# EAGLE design ac_alarm (EAGLE 5.09)
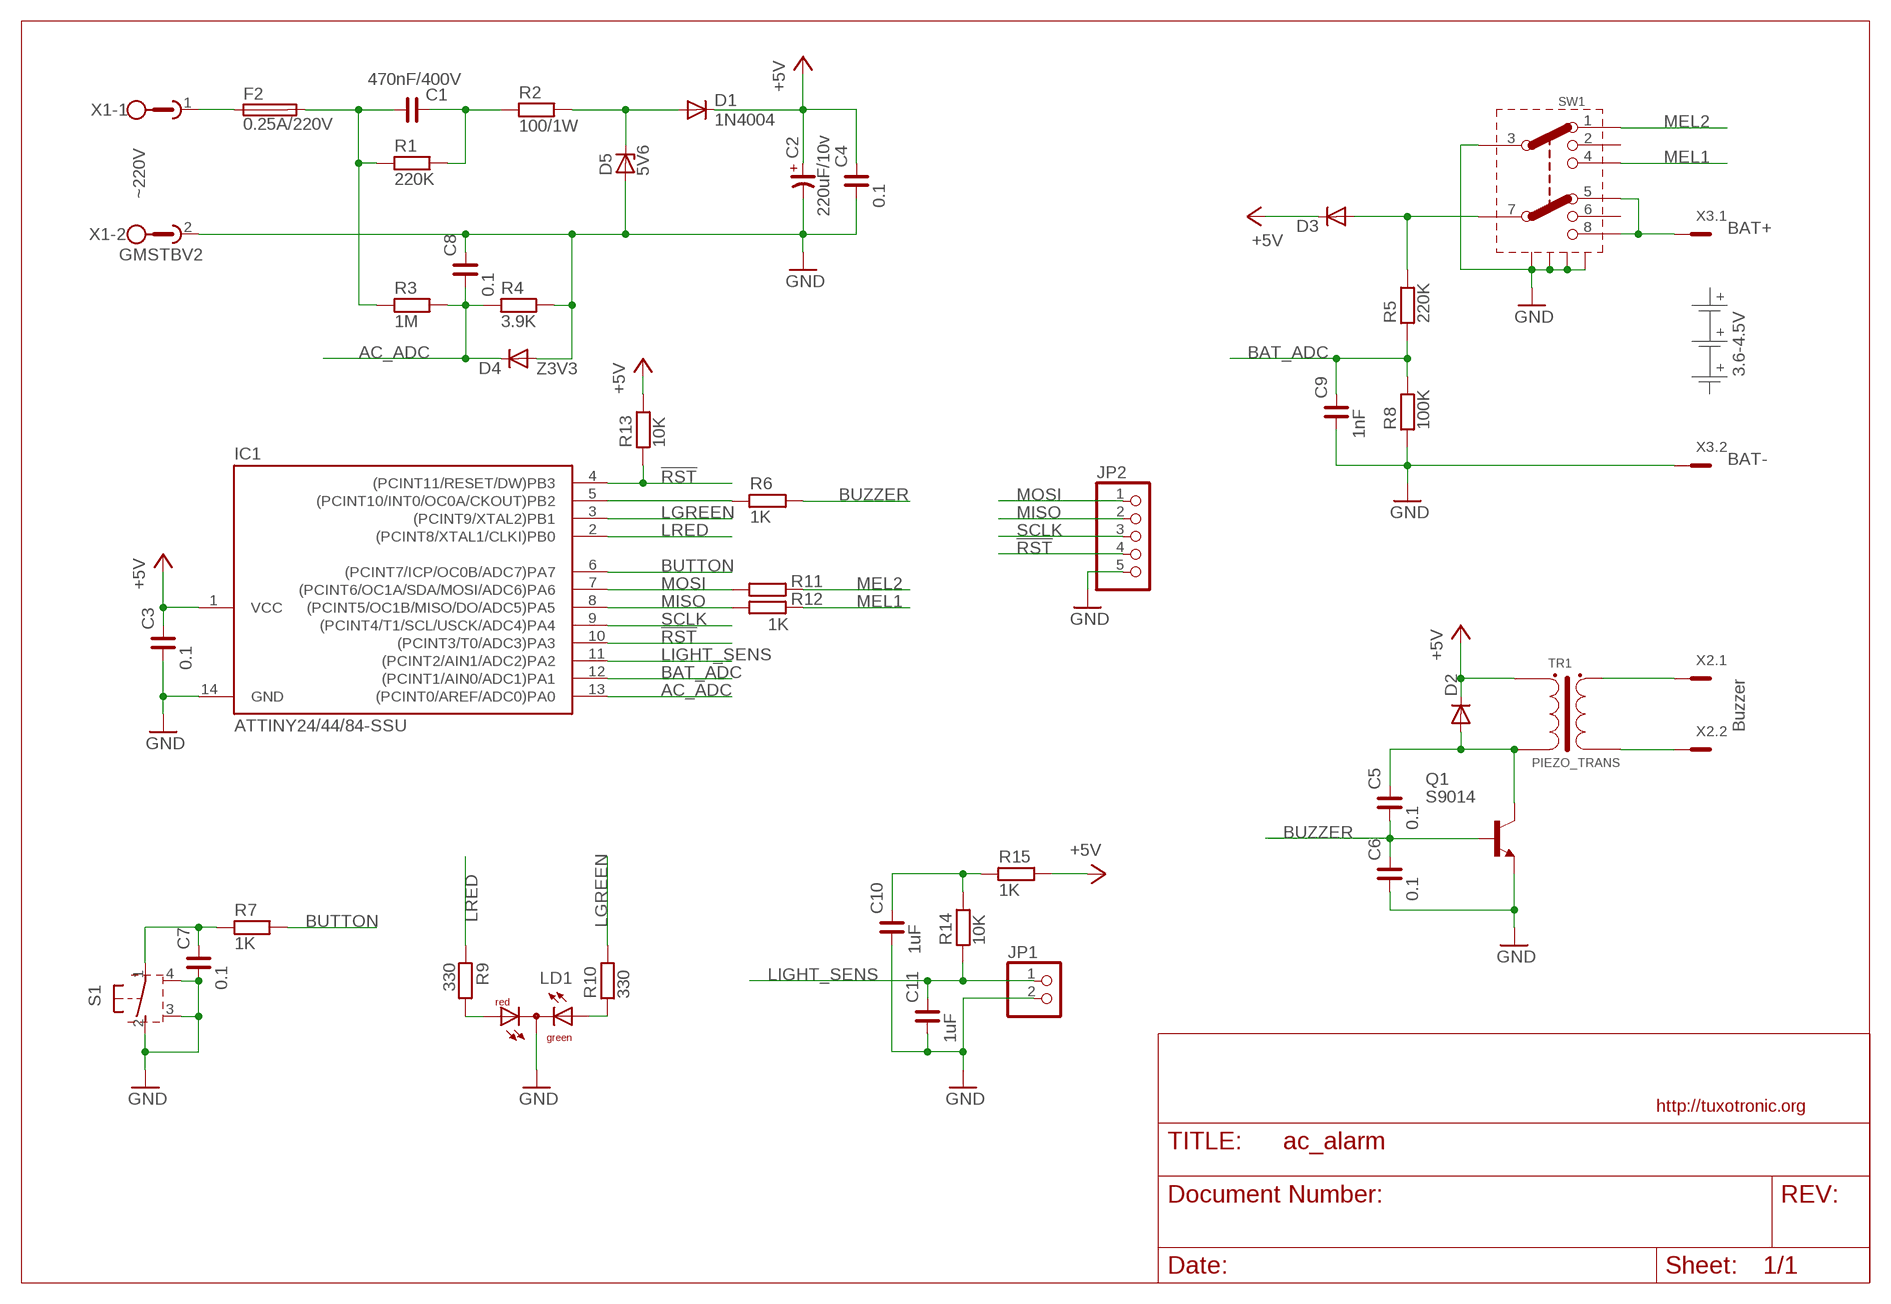
[diagram p0: schematic, sheet 1]

## Parts
C1  470nF/400V  C_C200-230X080  [C200-230X080]
C2  220uF/10v  CP_TT050-080  [CTT-050-080]
C3  0.1  C_0805  [C0805]
C4  0.1  C_C025-050X025  [C025-050X025]
C5  0.1  C_0805  [C0805]
C6  0.1  C_0805  [C0805]
C7  0.1  C_0805  [C0805]
C8  0.1  C_0805  [C0805]
C9  1nF  C_0805  [C0805]
C10  1uF  C_0805  [C0805]
C11  1uF  C_0805  [C0805]
D1  1N4004  1N4148DO35-10  [DO35-10]
D2  DIODE-MELF-MLL41  [MELF-MLL41]
D3  DIODE-MELF-MLL41  [MELF-MLL41]
D4  Z3V3  DIODE-MELF-MLL41  [MELF-MLL41]
D5  5V6  BZD23  [SOD81]
F2  0.25A/220V  PICOFUSE  [PICOFUSE]
IC1  ATTINY24/44/84-SSU  [SOIC14]
JP1  PINHD-1X2_2.54  [1X02]
JP2  PINHD-1X5_2.00  [1X05M]
LD1  DUOLED-RG-C  [DUOLED-C-5MM]
Q1  S9014  2N5089  [TO92]
R1  220K  R_X0309/10  [0309/10]
R2  100/1W  R_X0309/12  [0309/12]
R3  1M  R_0805  [R0805]
R4  3.9K  R_0805  [R0805]
R5  220K  R_0805  [R0805]
R6  1K  R_0805  [R0805]
R7  1K  R_0805  [R0805]
R8  100K  R_0805  [R0805]
R9  330  R_0805  [R0805]
R10  330  R_0805  [R0805]
R11  1K  R_0805  [R0805]
R12  1K  R_0805  [R0805]
R13  10K  R_0805  [R0805]
R14  10K  R_0805  [R0805]
R15  1K  R_0805  [R0805]
S1  31-XX  [B3F-31XX]
SW1  3SWITCH  [3SWITCH]
TR1  PIEZO_TRANS  [PIEZOTRANS]
X1  GMSTBV2  [GMSTBV2]
X2  MCV2  [MCV2]
X3  MCV2  [MCV2]

## Nets
!RST: IC1.4((PCINT11/RESET/DW)PB3) IC1.10((PCINT3/T0/ADC3)PA3) JP2.4 R13.1
+5V: C2.+ C3.2 C4.2 D1.C D2.C D3.C IC1.1(VCC) R13.2 R15.2 TR1.A1
AC_ADC: C8.1 D4.C IC1.13((PCINT0/AREF/ADC0)PA0) R3.2 R4.1
BAT_ADC: C9.2 IC1.12((PCINT1/AIN0/ADC1)PA1) R5.1 R8.2
BUTTON: IC1.6((PCINT7/ICP/OC0B/ADC7)PA7) R7.2
BUZZER: C5.1 C6.2 Q1.2(B) R6.2
GND: C2.- C3.1 C4.1 C6.1 C7.1 C8.2 C9.1 C10.1 C11.1 D4.A D5.A IC1.14(GND) JP1.2 JP2.5 LD1.C Q1.3(E) R4.2 R8.1 S1.2(S) S1.3(GND1) S1.4(GND2) SW1.3(AG) SW1.SH1 SW1.SH2 SW1.SH3 SW1.SH4 X1.2 X3.2
HOT: C1.1 F2.2 R1.1 R3.1
LGREEN: IC1.3((PCINT9/XTAL2)PB1) R10.2
LIGHT_SENS: C11.2 IC1.11((PCINT2/AIN1/ADC2)PA2) JP1.1 R14.1
LRED: IC1.2((PCINT8/XTAL1/CLKI)PB0) R9.1
MEL1: R12.2 SW1.4(A3)
MEL2: R11.2 SW1.1(A1)
MISO: IC1.8((PCINT5/OC1B/MISO/DO/ADC5)PA5) JP2.2 R12.1
MOSI: IC1.7((PCINT6/OC1A/SDA/MOSI/ADC6)PA6) JP2.1 R11.1
N$1: F2.1 X1.1
N$2: C1.2 R1.2 R2.1
N$3: D1.A D5.C R2.2
N$4: C5.2 D2.A Q1.1(C) TR1.A2
N$5: LD1.AR R9.2
N$6: TR1.B1 X2.1
N$7: TR1.B2 X2.2
N$8: C7.2 R7.1 S1.1(P)
N$9: SW1.5(B1) SW1.8(B3) X3.1
N$10: D3.A R5.2 SW1.7(BG)
N$11: LD1.AX(AG) R10.1
N$12: IC1.5((PCINT10/INT0/OC0A/CKOUT)PB2) R6.1
N$14: C10.2 R14.2 R15.1
SCLK: IC1.9((PCINT4/T1/SCL/USCK/ADC4)PA4) JP2.3
Unconnected: SW1.2(A2) SW1.6(B2)

## Notes on the sheet
- ~220V
- BAT+
- 3.6-4.5V
- BAT-
- Buzzer

## Library data of the parts
C1 C3-C11 = rc-master:C_: NON-POLARIZED CAP
C2 = rc-master:CP_: POLARIZED CAP
D1 = diode:1N4148: DIODE high speed (Philips)
D2-D4 = discrete:DIODE-: DIODE
D5 = diode:BZD23: Z DIODE
F2 = fuse:PICOFUSE: PICOFUSE 19275, Wickmann
IC1 = attiny24_44_84:ATTINY24/44/84
JP1 = pinhead-fixdrills:PINHD-1X2: PIN HEADER
JP2 = pinhead-fixdrills:PINHD-1X5: PIN HEADER
LD1 = led:DUOLED-RG-C: DUO LED 2 colors (red/green), 5 mm, round, common Cathode www.ligitek.com or other producers.
Q1 = transistor-npn:2N5089: NPN Transistor
R1-R4 R7 = rc-master:R_: RESISTOR
R5 R6 R8-R15 = rc-master-smd:R_: RESISTOR
S1 = buttons:31-XX: OMRON SWITCH
SW1 = switch:3SWITCH
TR1 = switch:PIEZO_TRANS
X1 = con-phoenix-508:GMSTBV2: PHOENIX
X2 X3 = con-phoenix-381_l:MCV2: Mini-Combicon 3.81mm vertikal 2polig (ohne Gegenstecker)

## Board
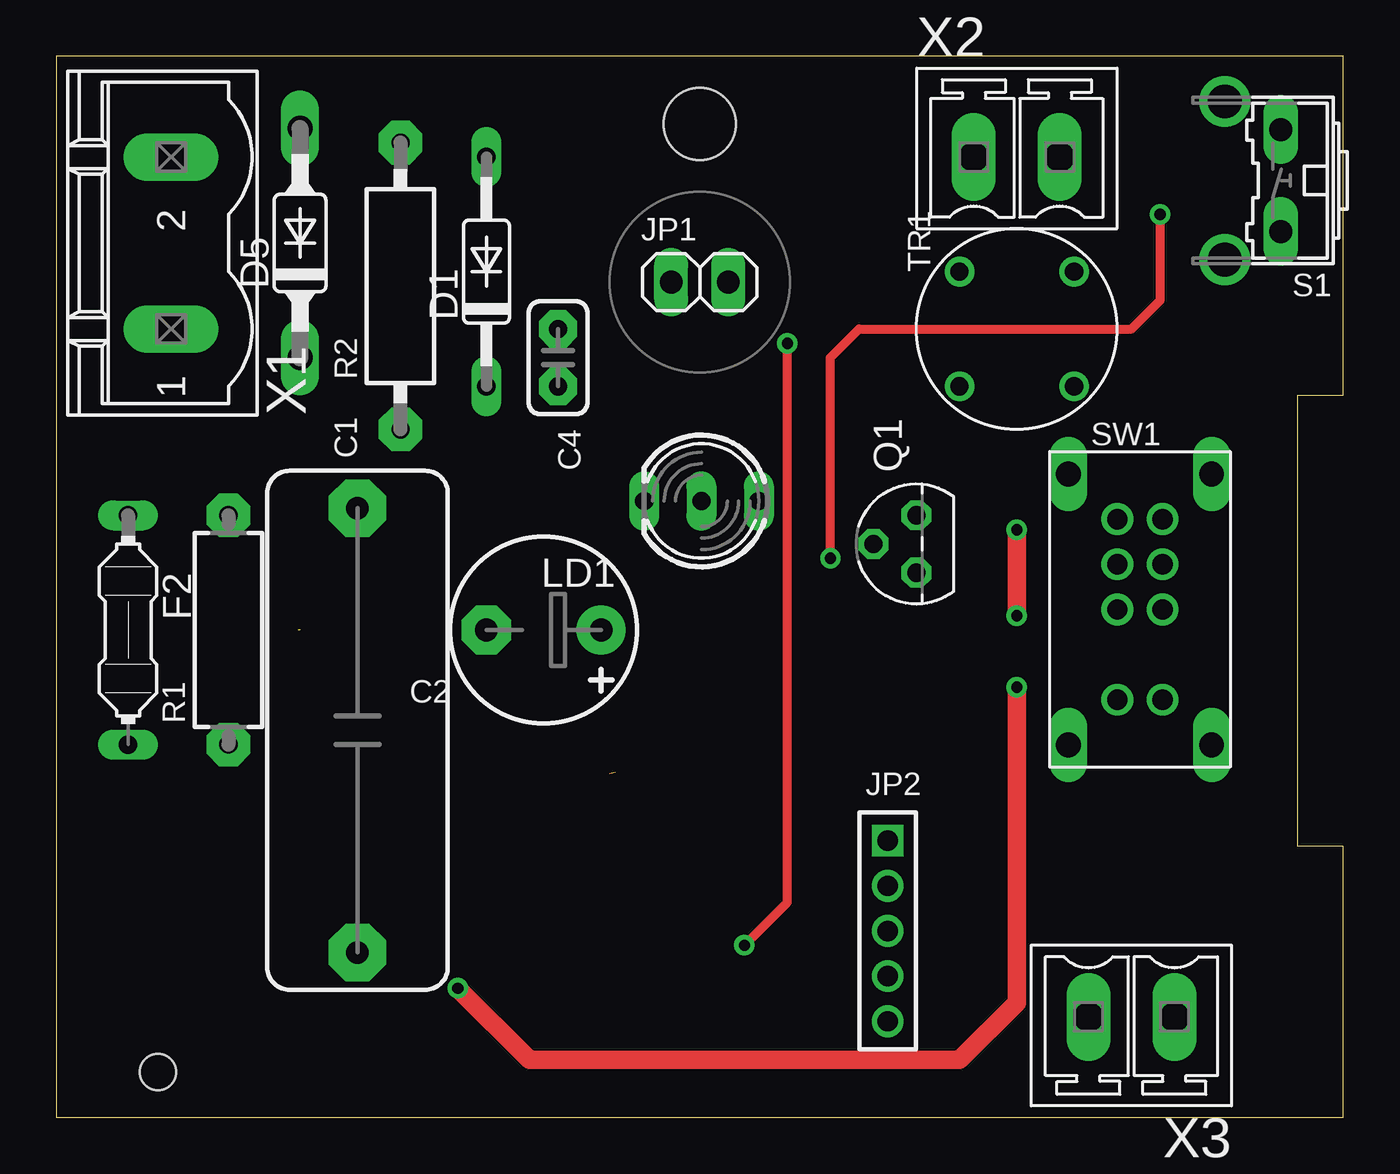
[diagram p1: board, top side]
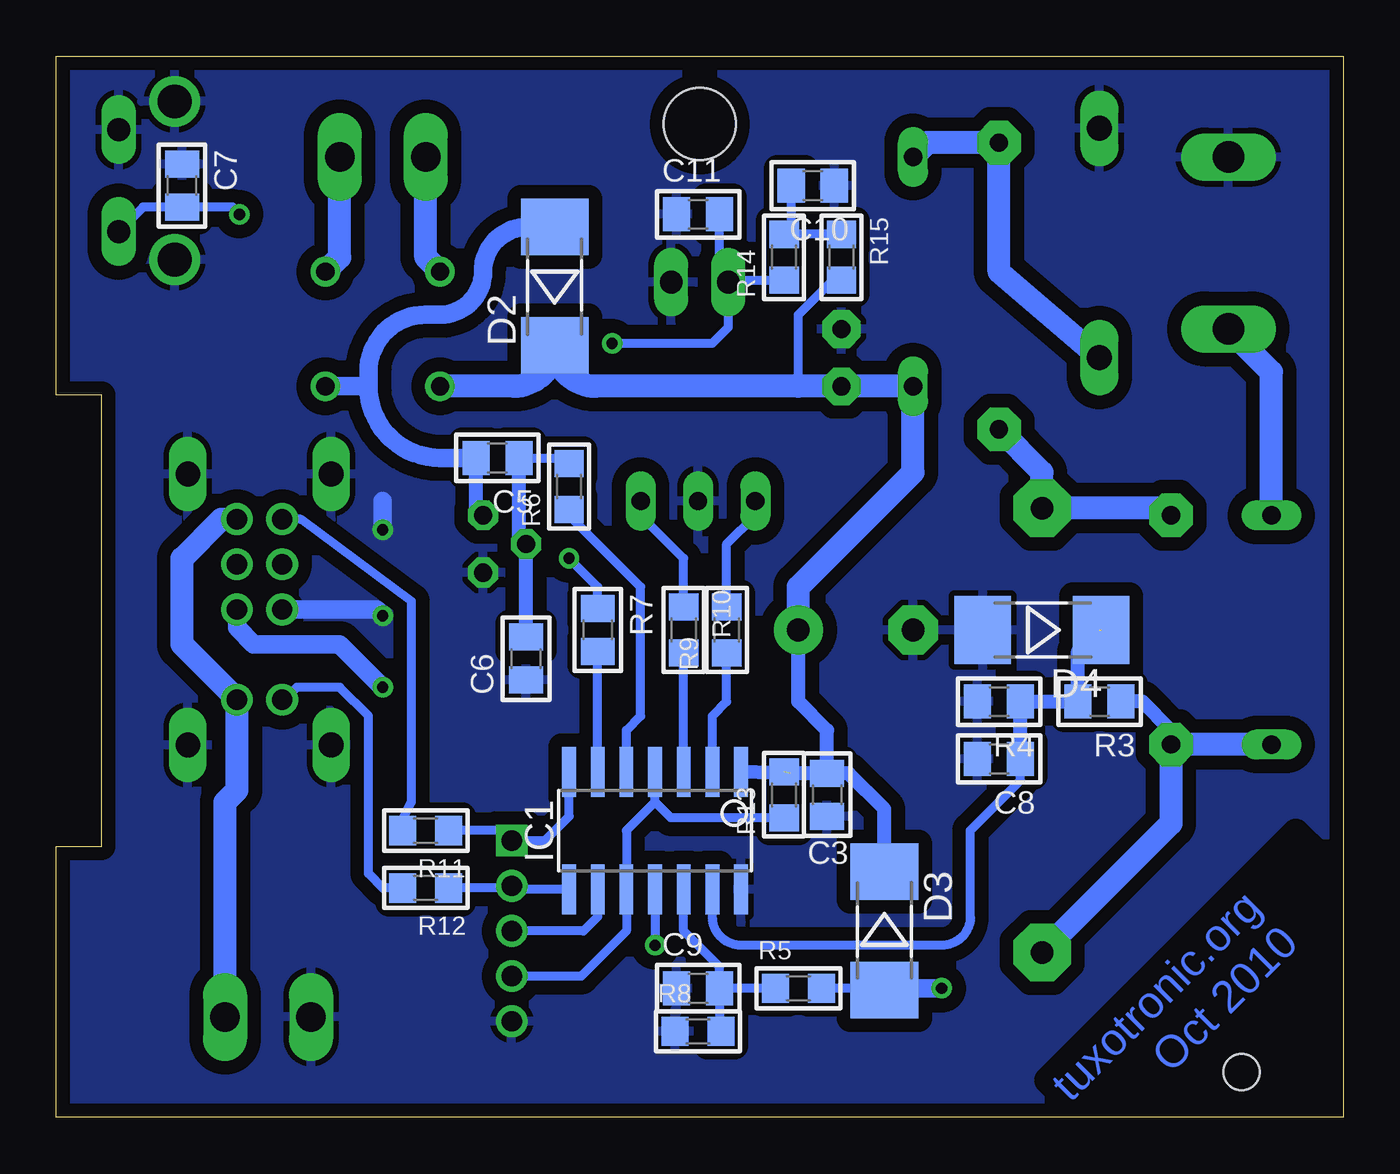
[diagram p2: board, bottom side, seen from below]

Size 57 x 47 mm. Coordinates in mm from the lower left corner, seen from the top.
Outline: 0,0 57,0 57,12 55,12 55,32 57,32 57,47 0,47 0,0
Copper layers (1*16): Top 0.035mm / dielectric 1.5mm / Bottom 0.035mm
Design rules "default *": minimum track width 10mil, minimum drill 24mil, track to track 8mil, track to pad 8mil, pad to pad 8mil, via to via 8mil, smd to smd 8mil, copper to edge 0.5mm, drill to drill 8mil, minimum pad ring 10mil, minimum via ring 8mil, stop-mask expansion 4mil, vias tented up to drill 0mil, thermal gap 10mil
Holes 3.2 mm at 28.5,44
Holes 1.6 mm at 4.5,2

### Footprints (pad centres in the part's own frame; a part is rotated, then mirrored left to right if it is on the bottom)
C200-230X080 = drill 1 pad 2.54 octagon: 1 -9.842,0; 2 9.842,0
CTT-050-080 = drill 1 pad 2.184 round: + -2.54,0 | drill 1 pad 2.184 octagon: - 2.54,0
C0805 = smd 1.2 x 1.5: 1 -0.953,0; 2 0.953,0
C025-050X025 = drill 0.8 pad 1.676 octagon: 1 -1.27,0; 2 1.27,0
DO35-10 = drill 0.813 long: A 5.08,0; C -5.08,0
MELF-MLL41 = smd 2.5 x 3: A 2.625,0; C -2.625,0
SOD81 = drill 1.118 long: A 5.08,0; C -5.08,0
PICOFUSE = drill 0.813 long: 1 -5.08,0; 2 5.08,0
SOIC14 = smd 0.61 x 2.21: 1 -3.81,-2.603; 2 -2.54,-2.603; 3 -1.27,-2.603; 4 0,-2.603; 5 1.27,-2.603; 6 2.54,-2.603; 7 3.81,-2.603; 8 3.81,2.603; 9 2.54,2.603; 10 1.27,2.603; 11 0,2.603; 12 -1.27,2.603; 13 -2.54,2.603; 14 -3.81,2.603
1X02 = drill 1 long: 1 -1.27,0; 2 1.27,0
1X05M = drill 0.9 square: 1 -4,0 | drill 0.9 round: 2 -2,0; 3 0,0; 4 2,0; 5 4,0
DUOLED-C-5MM = drill 0.813 long: AR 2.54,0; AX -2.54,0; C 0,0
TO92 = drill 0.813 octagon: 1 1.27,0; 2 0,1.905; 3 -1.27,0
0309/10 = drill 0.8 pad 1.93 octagon: 1 -5.08,0; 2 5.08,0
0309/12 = drill 0.8 pad 1.93 octagon: 1 -6.35,0; 2 6.35,0
R0805 = smd 1.2 x 1.5: 1 -0.953,0; 2 0.953,0
R0805' = smd 1.2 x 1.3: 1 -1.016,0; 2 1.016,0
B3F-31XX = drill 1.016 long: 1 -2.261,-1.245; 2 2.261,-1.245 | drill 1.499 pad 2.159 round: 3 -3.505,1.245; 4 3.505,1.245
3SWITCH = drill 0.9 round: 1 -4,-1; 2 -2,-1; 3 0,-1; 4 4,-1; 5 -4,1; 6 -2,1; 7 0,1; 8 4,1 | drill 1.1 long: SH1 -6,3.175; SH2 6,3.175; SH3 -6,-3.175; SH4 6,-3.175
PIEZOTRANS = drill 0.8 round: A1 -2.54,2.54; A2 -2.54,-2.54; B1 2.54,2.54; B2 2.54,-2.54
GMSTBV2 = drill 1.4 long: 1 -3.81,0; 2 3.81,0
MCV2 = drill 1.3 pad 1.905 long: 1 -1.905,0; 2 1.905,0

### Placement (x,y rotation side)
C1  13.34,17.14 90 top
C2  21.59,21.59 180 top
C3  22.86,14.29 90 bottom
C4  22.23,33.66 270 top
C5  37.47,29.21 180 bottom
C6  36.2,20.32 90 bottom
C7  51.44,41.27 270 bottom
C8  15.24,15.88 180 bottom
C9  28.57,5.71 0 bottom
C10  23.5,41.27 180 bottom
C11  28.57,40.01 0 bottom
D1  19.05,37.47 90 top
D2  34.92,36.83 90 bottom
D3  20.32,8.26 270 bottom
D4  13.34,21.59 180 bottom
D5  10.79,38.73 90 top
F2  3.17,21.59 270 top
IC1  30.48,12.7 180 bottom
JP1  28.5,37 0 top
JP2  36.83,8.26 270 top
LD1  28.57,27.3 180 top
Q1  38.1,25.4 90 top
R1  7.62,21.59 90 top
R2  15.24,36.83 90 top
R3  10.79,18.41 180 bottom
R4  15.24,18.41 180 bottom
R5  220K  [R0805']  24.13,5.71 0 bottom
R6  1K  [R0805']  34.29,27.94 90 bottom
R7  33.02,21.59 270 bottom
R8  100K  [R0805']  28.57,3.81 0 bottom
R9  330  [R0805']  27.3,21.59 90 bottom
R10  330  [R0805']  29.21,21.59 270 bottom
R11  1K  [R0805']  40.64,12.7 180 bottom
R12  1K  [R0805']  40.64,10.16 180 bottom
R13  10K  [R0805']  24.77,14.29 90 bottom
R14  10K  [R0805']  24.77,38.1 90 bottom
R15  1K  [R0805']  22.23,38.1 270 bottom
S1  53,41.5 90 top
SW1  48,22.5 270 top
TR1  42.55,34.92 90 top
X1  5.08,38.73 90 top
X2  42.55,42.55 0 top
X3  47.62,4.45 180 top

### Tracks (layer width: path | path; a pad name or v marks a point on that pad's centre or on a via)
!RST
  Bottom 0.406: JP2.4 33.75,6.25 31.75,8.26 IC1.10 31.75,12.7 30.48,13.97 | 30.48,13.97 IC1.4 | R13.1 29.78,13.27 30.48,13.97
+5V  (1 unrouted)
  Bottom 0.406: R15.2 22.61,37.08 24.13,35.56 24.13,32.38
  Bottom 0.61: C3.2 24.51,15.24 IC1.1 | C3.2 22.86,17.14 24.13,18.41 C2.+ | C3.2 21.91,15.24 20.32,13.65 D3.C
  Bottom 1.016: C2.+ 24.13,23.5 19.05,28.57 D1.C C4.2 24.13,32.38 33.1,32.38 arc90 D2.C arc90 36.74,32.38 TR1.A1
AC_ADC  (1 unrouted)
  Bottom 0.406: IC1.13 27.94,8.89 arc-90 26.67,7.62 17.78,7.62 arc-90 16.51,8.89 16.51,12.7 14.29,14.92 C8.1
  Bottom 0.61: C8.1 R4.1 R3.2 11.75,20.64 10.79,21.59
BAT_ADC
  Bottom 0.406: 27.3,4.06 R8.2 27.62,3.87 C9.2 | IC1.12 29.21,8.26 27.62,6.67 C9.2 | R5.1 C9.2
BUTTON
  Bottom 0.406: IC1.6 R7.2
BUZZER
  Bottom 0.406: C5.1 34.54,29.21 R6.2
  Bottom 0.61: C5.1 36.51,25.72 Q1.2 C6.2
GND  (via drill 0.5)
  Top 0.813: v42.55,22.23 v42.55,26.04
  Bottom 0.813: SW1.3 42.82,22.5 v42.55,22.23 | v42.55,26.04 42.55,27.3
  pour Bottom (isolate 0.61): -0.64,47.62 57.78,47.62 57.78,-0.64 -0.64,-0.64
HOT
  Bottom 0.61: R1.1 7.62,17.14 8.89,18.41 R3.1
  Bottom 1.016: F2.2 R1.1 7.62,13.02 C1.1
LGREEN
  Bottom 0.406: IC1.3 R10.2
LIGHT_SENS  (via drill 0.5)
  Top 0.406: v32.38,34.29 32.38,9.53 v30.48,7.62
  Bottom 0.406: R14.1 27.15,37.08 JP1.1 | C11.2 27.62,37.39 JP1.1 | JP1.1 27.23,35 27.94,34.29 v32.38,34.29 | IC1.11 v30.48,7.62
LRED
  Bottom 0.406: IC1.2 27.94,17.78 27.3,18.41 R9.1
MEL1
  Bottom 0.406: SW1.4 46.91,18.5 46.35,19.05 44.45,19.05 43.18,17.78 43.18,10.79 42.55,10.16 R12.2
MEL2
  Bottom 0.406: SW1.1 46.19,26.5 41.27,22.86 41.27,13.97 41.91,12.7 R11.2
MISO
  Bottom 0.406: IC1.8 36.67,10.1 JP2.2 36.92,10.16 R12.1
MOSI
  Bottom 0.406: IC1.7 34.29,13.34 35.37,12.26 JP2.1 37.27,12.7 R11.1
N$1
  Bottom 1.016: F2.1 3.17,33.02 X1.1
N$2
  Bottom 1.016: R1.2 7.94,26.99 C1.2 13.34,28.57 R2.1
N$3
  Bottom 1.016: D5.C 15.24,37.47 R2.2 18.41,43.18 D1.A
N$4
  Bottom 0.61: C5.2 38.42,26.99 Q1.1
  Bottom 0.813: D2.A 36.11,39.45 arc-90 38.1,37.47 arc90 40.01,35.56 40.64,35.56 arc-90 43.18,33.02 43.18,32.38 | C5.2 40.01,29.21 arc90 43.18,32.38 | 43.18,32.38 TR1.A2
N$5
  Bottom 0.406: LD1.AR 26.04,26.67 27.3,25.4 R9.2
N$6
  Bottom 1.016: X2.1 40.64,38.1 TR1.B1
N$7
  Bottom 1.016: X2.2 44.45,38.1 TR1.B2
N$8  (via drill 0.5)
  Top 0.406: v48.9,40.01 48.9,36.2 47.62,34.92 35.56,34.92 34.29,33.66 v34.29,24.77
  Bottom 0.406: S1.1 53.16,40.32 C7.2 49.21,40.32 v48.9,40.01 | R7.1 33.02,23.5 v34.29,24.77
N$9
  Bottom 1.016: X3.1 49.53,13.97 49,14.5 SW1.8 49,18.52 51.44,20.95 51.44,24.77 49.7,26.5 SW1.5
N$10  (via drill 0.5)
  Top 0.813: v17.78,5.71 20.95,2.54 40.01,2.54 42.55,5.08 v42.55,19.05
  Bottom 0.406: R5.2 20.41,5.71 D3.A
  Bottom 0.813: SW1.7 49,21.7 48.26,20.95 44.45,20.95 v42.55,19.05 | v17.78,5.71 20.23,5.71 D3.A
N$11
  Bottom 0.406: R10.1 29.21,24.77 31.11,26.67 LD1.AX
N$12
  Bottom 0.406: R6.1 34.29,26.67 31.11,23.5 31.11,17.78 31.75,17.14 IC1.5
N$14
  Bottom 0.406: R15.1 R14.2 24.45,39.43 C10.2
SCLK
  Bottom 0.406: JP2.3 33.66,8.26 33.02,8.89 IC1.9

### Text on the board
Bottom: Oct 2010 | tuxotronic.org